# Altium schematic sheet Micro_controller.SchDoc (part 3 of 3)
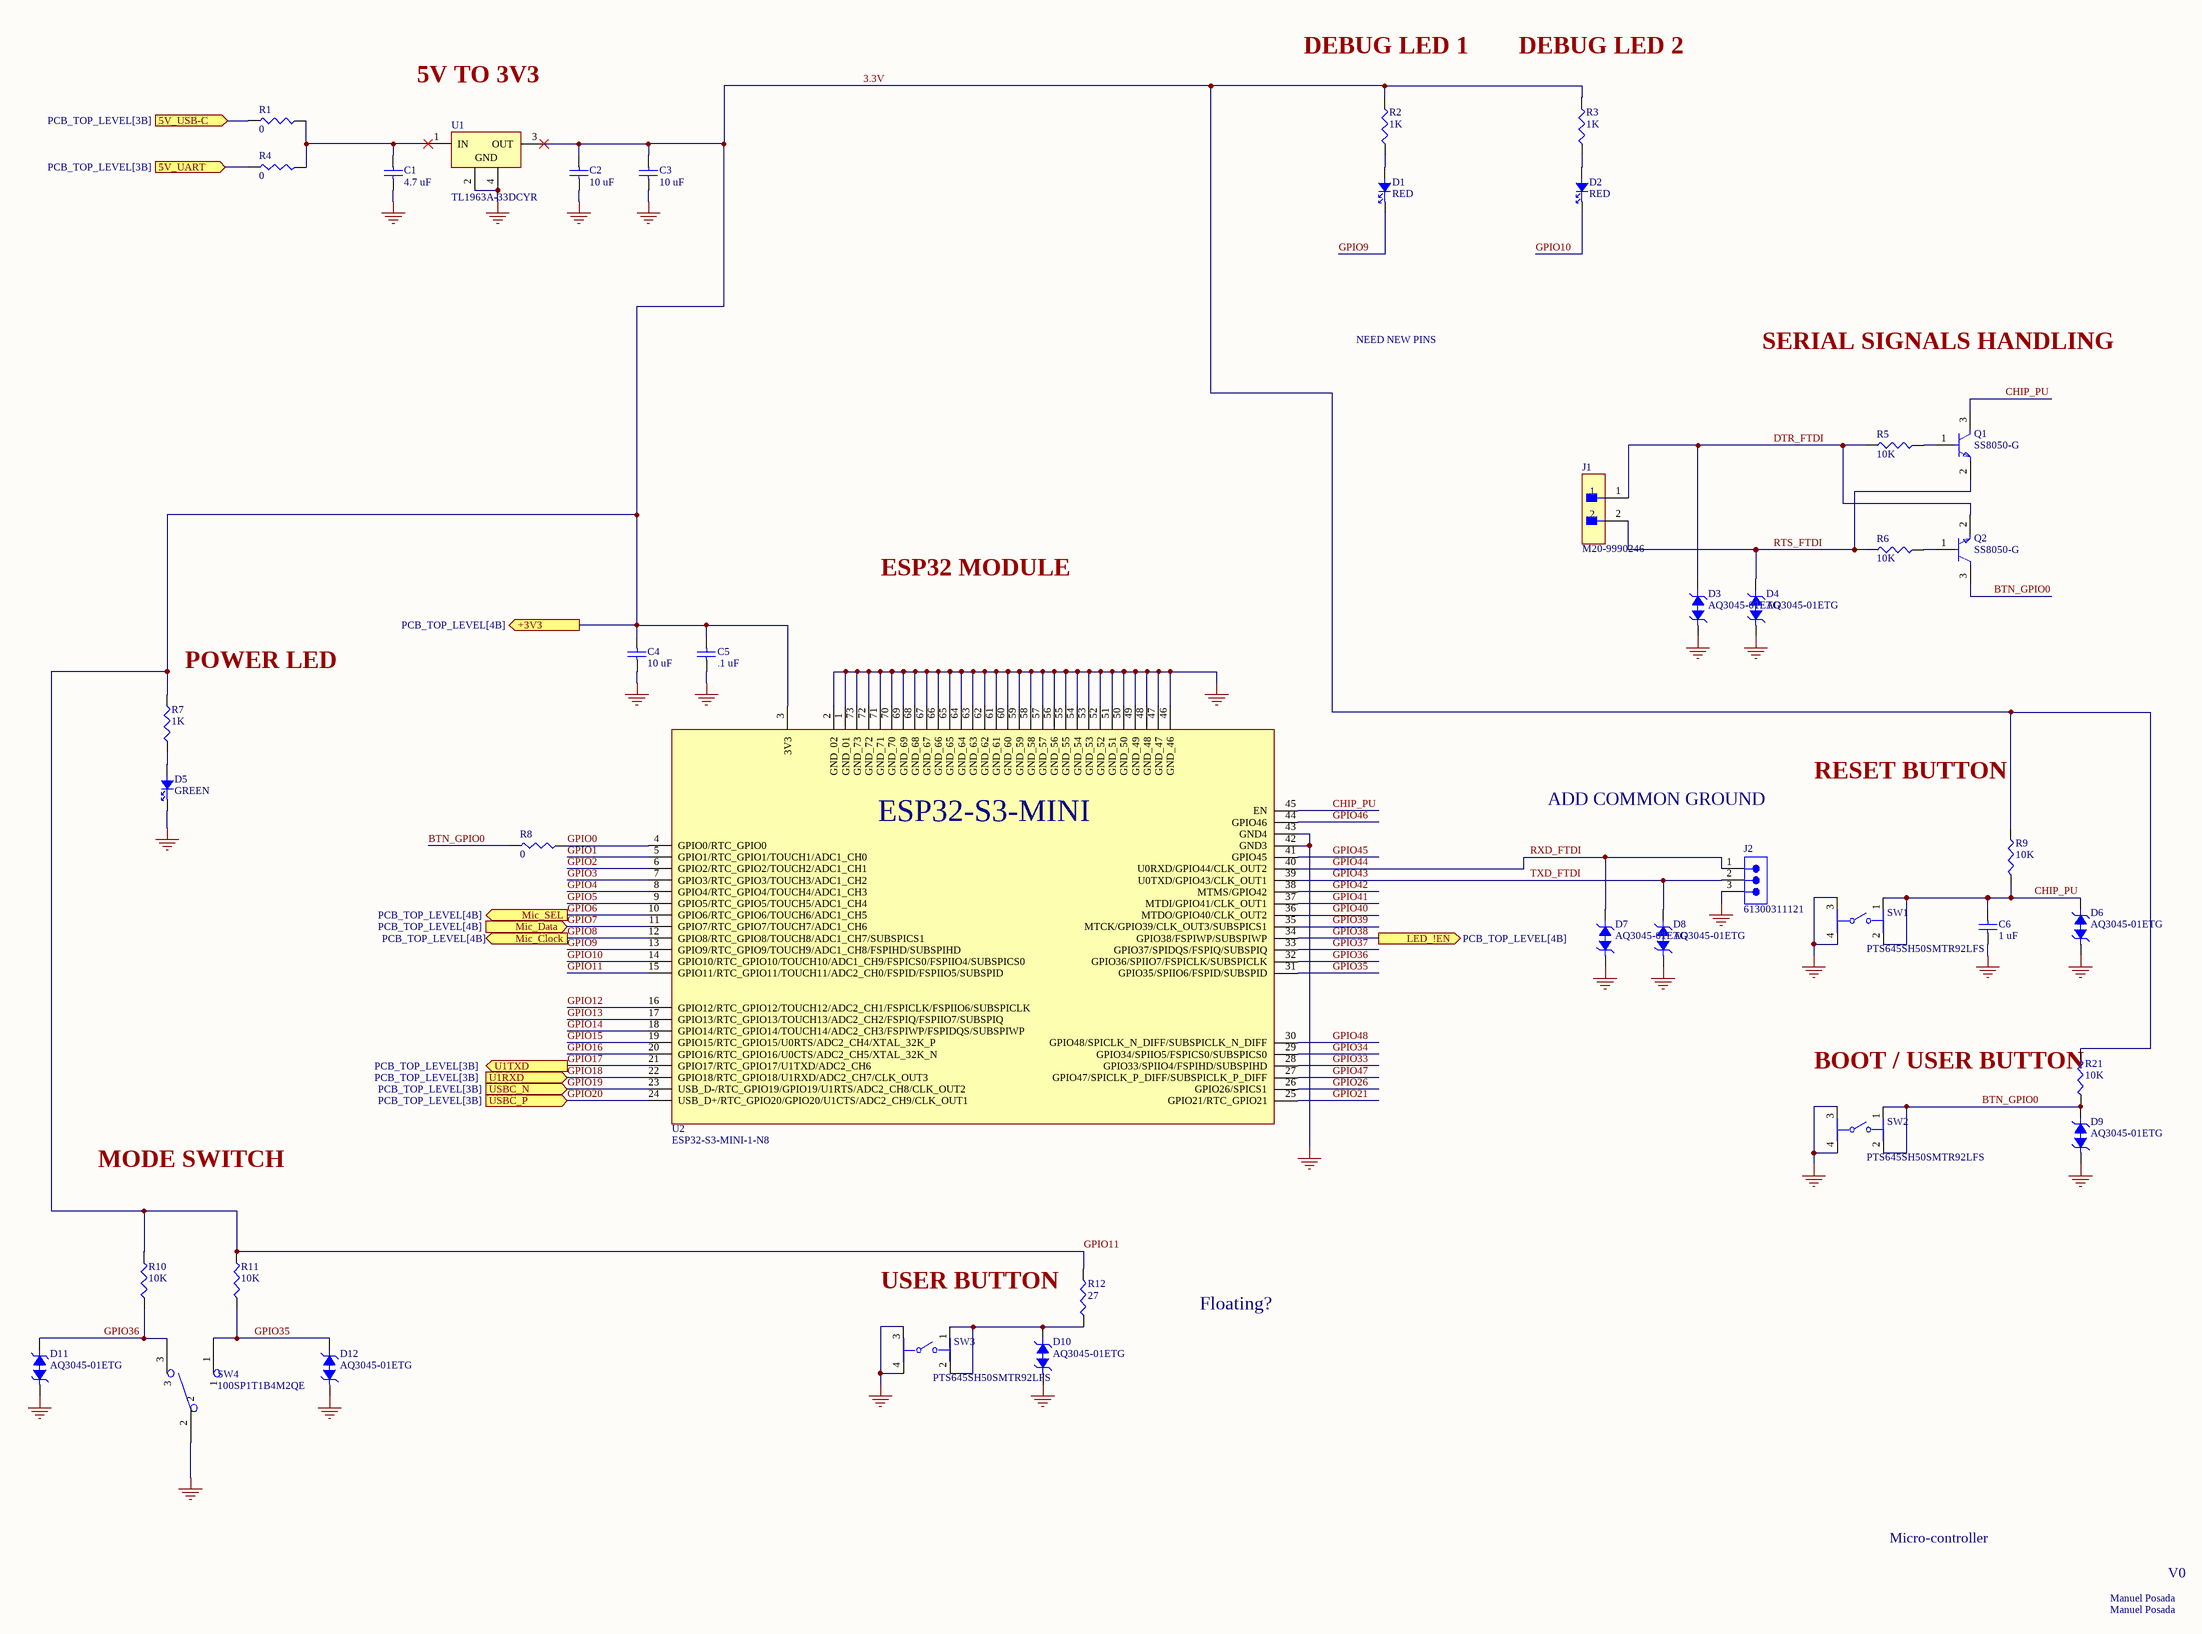
[diagram p2: Micro_controller.SchDoc]

## Library data of the parts (continued)
SW4 = 100SP1T1B4M2QE: Switch Toggle ON None ON SPDT Round Lever PC Pins 5A 250VAC 28VDC PC Mount; Manufacturer: E-Switch; Actuator Length: 10.414mm; Actuator Material: Brass, Chrome; Contact Voltage Rating (AC): 120V; Electrical Life: 50kcycles; Illumination Type: Illuminated, Non-Illuminated; Max Voltage Rating (DC): 28V; Number of Positions: 2; Sealable: EPOXY TERMINAL SEALED; Switch Function: On-On; Supplier: DigiKey; Supplier Part Number: EG2355-ND; Manufacturer Part Number: 100SP1T1B4M2QE; RoHS: Compliant; Category: Toggle Switches; Stock: 13324; Pricing: 1=2.63, 10=2.272, 25=2.1428, 50=2.05, 108=1.9513, 324=1.81836, 540=1.75957, 1080=1.68271 (USD); Contact Current Rating: 5A; Contact Plating: Silver; Country of Origin: Mainland China; Current Rating: 5A; Export Control Classification Number (ECCN) Code: EAR99; Height: 8.89mm; Harmonized Tariff Schedule (HTS) Code: 8536.50.70.00; Introduction Date: 2011-01-05; Lead Free: Lead Free; Length: 12.7mm; Lifecycle Status: Production; Max Current Rating: 5A; Max Operating Temperature: 85°C; Min Operating Temperature: -30°C; Mounting Technology: Through Hole; Orientation: Vertical; REACH SVHC: Yes; Termination: PC Pin; Throw Configuration: SPDT; Voltage Rating (AC): 120V; Voltage Rating (DC): 28V; ComponentLink1URL: https://datasheet.octopart.com:443/100SP1T1B4M2QE-E-Switch-datasheet-17722722.pdf?src-supplier=IHS; ComponentLink1Description: https://datasheet.octopart.com:443/100SP1T1B4M2QE-E-Switch-datasheet-17722722.pdf?src-supplier=IHS; ComponentLink2URL: https://datasheet.octopart.com:443/100SP1T1B4M2QE-E-Switch-datasheet-112052116.pdf?src-supplier=Farnell; ComponentLink2Description: https://datasheet.octopart.com:443/100SP1T1B4M2QE-E-Switch-datasheet-112052116.pdf?src-supplier=Farnell; ComponentLink3URL: https://datasheet.octopart.com:443/100SP1T1B4M2QE-E-Switch-datasheet-178529814.pdf?src-supplier=Future+Electronics; ComponentLink3Description: https://datasheet.octopart.com:443/100SP1T1B4M2QE-E-Switch-datasheet-178529814.pdf?src-supplier=Future+Electronics; ComponentLink4URL: https://datasheet.octopart.com:443/100SP1T1B4M2QE-E-Switch-datasheet-41351065.pdf?src-supplier=element14+APAC; ComponentLink4Description: https://datasheet.octopart.com:443/100SP1T1B4M2QE-E-Switch-datasheet-41351065.pdf?src-supplier=element14+APAC; ComponentLink5URL: https://datasheet.octopart.com:443/100SP1T1B4M2QE-E-Switch-datasheet-501321.pdf?src-supplier=Newark; ComponentLink5Description: https://datasheet.octopart.com:443/100SP1T1B4M2QE-E-Switch-datasheet-501321.pdf?src-supplier=Newark
U1 = TL1963A-33DCYR: IC REG LINEAR 3.3V 1.5A SOT223-4; Manufacturer: Texas Instruments; Package Body Material: Plastic; Adjustability: FIXED; Dropout Voltage1-Max: 550mV; Dropout Voltage1-Nom: 340mV; Input Voltage Absolute-Max: 20V; Min Input Voltage: 3.8V; Line Regulation-Max: 0.01%; Load Regulation-Max: 0.07%; Channels: 1; Output Voltage1-Max: 3.4V; Output Voltage1-Min: 3.2V; Regulator Type: FIXED POSITIVE SINGLE OUTPUT LDO REGULATOR; Voltage Tolerance-Max: 3%; Qualification Status: Not Qualified; Supplier: Digikey; Supplier Part Number: 296-24897-1-ND; Manufacturer Part Number: TL1963A-33DCYR; RoHS: Yes; Category: Voltage Regulators - Linear; Stock: 4105; Pricing: 1=2.91, 10=2.614, 25=2.4712, 100=2.1417, 250=2.03188, 500=1.8232, 1000=1.53764 (USD); Case/Package: SOP; Pins: 4; Package Shape: Rectangular; Terminal Finish: Tin; JESD-609 Code: e3; Max Supply Voltage: 20V; JESD-30 Code: R-PDSO-G4; Moisture Sensitivity Level: 2; Number of Outputs: 1; Operating Temperature, TJ-Max: 125°C; Operating Temperature, TJ-Min: -40°C; Output Current1-Max: 1.5A; Output Voltage1-Nom: 3.3V; Package Style: SMALL OUTLINEMeter; Packaging: Tape and Reel; Peak Reflow Temperature (Cel): 260°C; Surface Mount: Yes; Technology: BIPOLAR; Terminal Form: Gull Wing; Terminal Position: DUAL; Length: 6.5mm; Width: 3.5mm; Height - Seated (Max): 1.8mm; Terminal Pitch: 2.3mm; Reach SVHC Compliant: Yes; RoHS Compliant: Yes; ComponentLink1URL: https://www.ti.com:443/lit/ds/symlink/tl1963a.pdf?src-supplier=IHS+Markit; ComponentLink1Description: https://www.ti.com:443/lit/ds/symlink/tl1963a.pdf?src-supplier=IHS+Markit; ComponentLink2URL: https://datasheet.ciiva.com/2046/-2046068.pdf?src-supplier=Digikey; ComponentLink2Description: https://datasheet.ciiva.com/2046/-2046068.pdf?src-supplier=Digikey; LCSC Part Number: C181262
U2 = ESP32-S3-MINI-1-N8: SMD Module, ESP32-S3FN8, 8 mb Sp; Manufacturer: Espressif Systems; Supplier: Digikey; Supplier Part Number: 1965-ESP32-S3-MINI-1-N8CT-ND; Manufacturer Part Number: ESP32-S3-MINI-1-N8; RoHS: No; Category: LDO; Stock: 2024; Pricing: 1=3.1 (USD); LCSC Part Number: C2913206